# EAGLE schematic 6packRev2A (EAGLE 9.2.0)
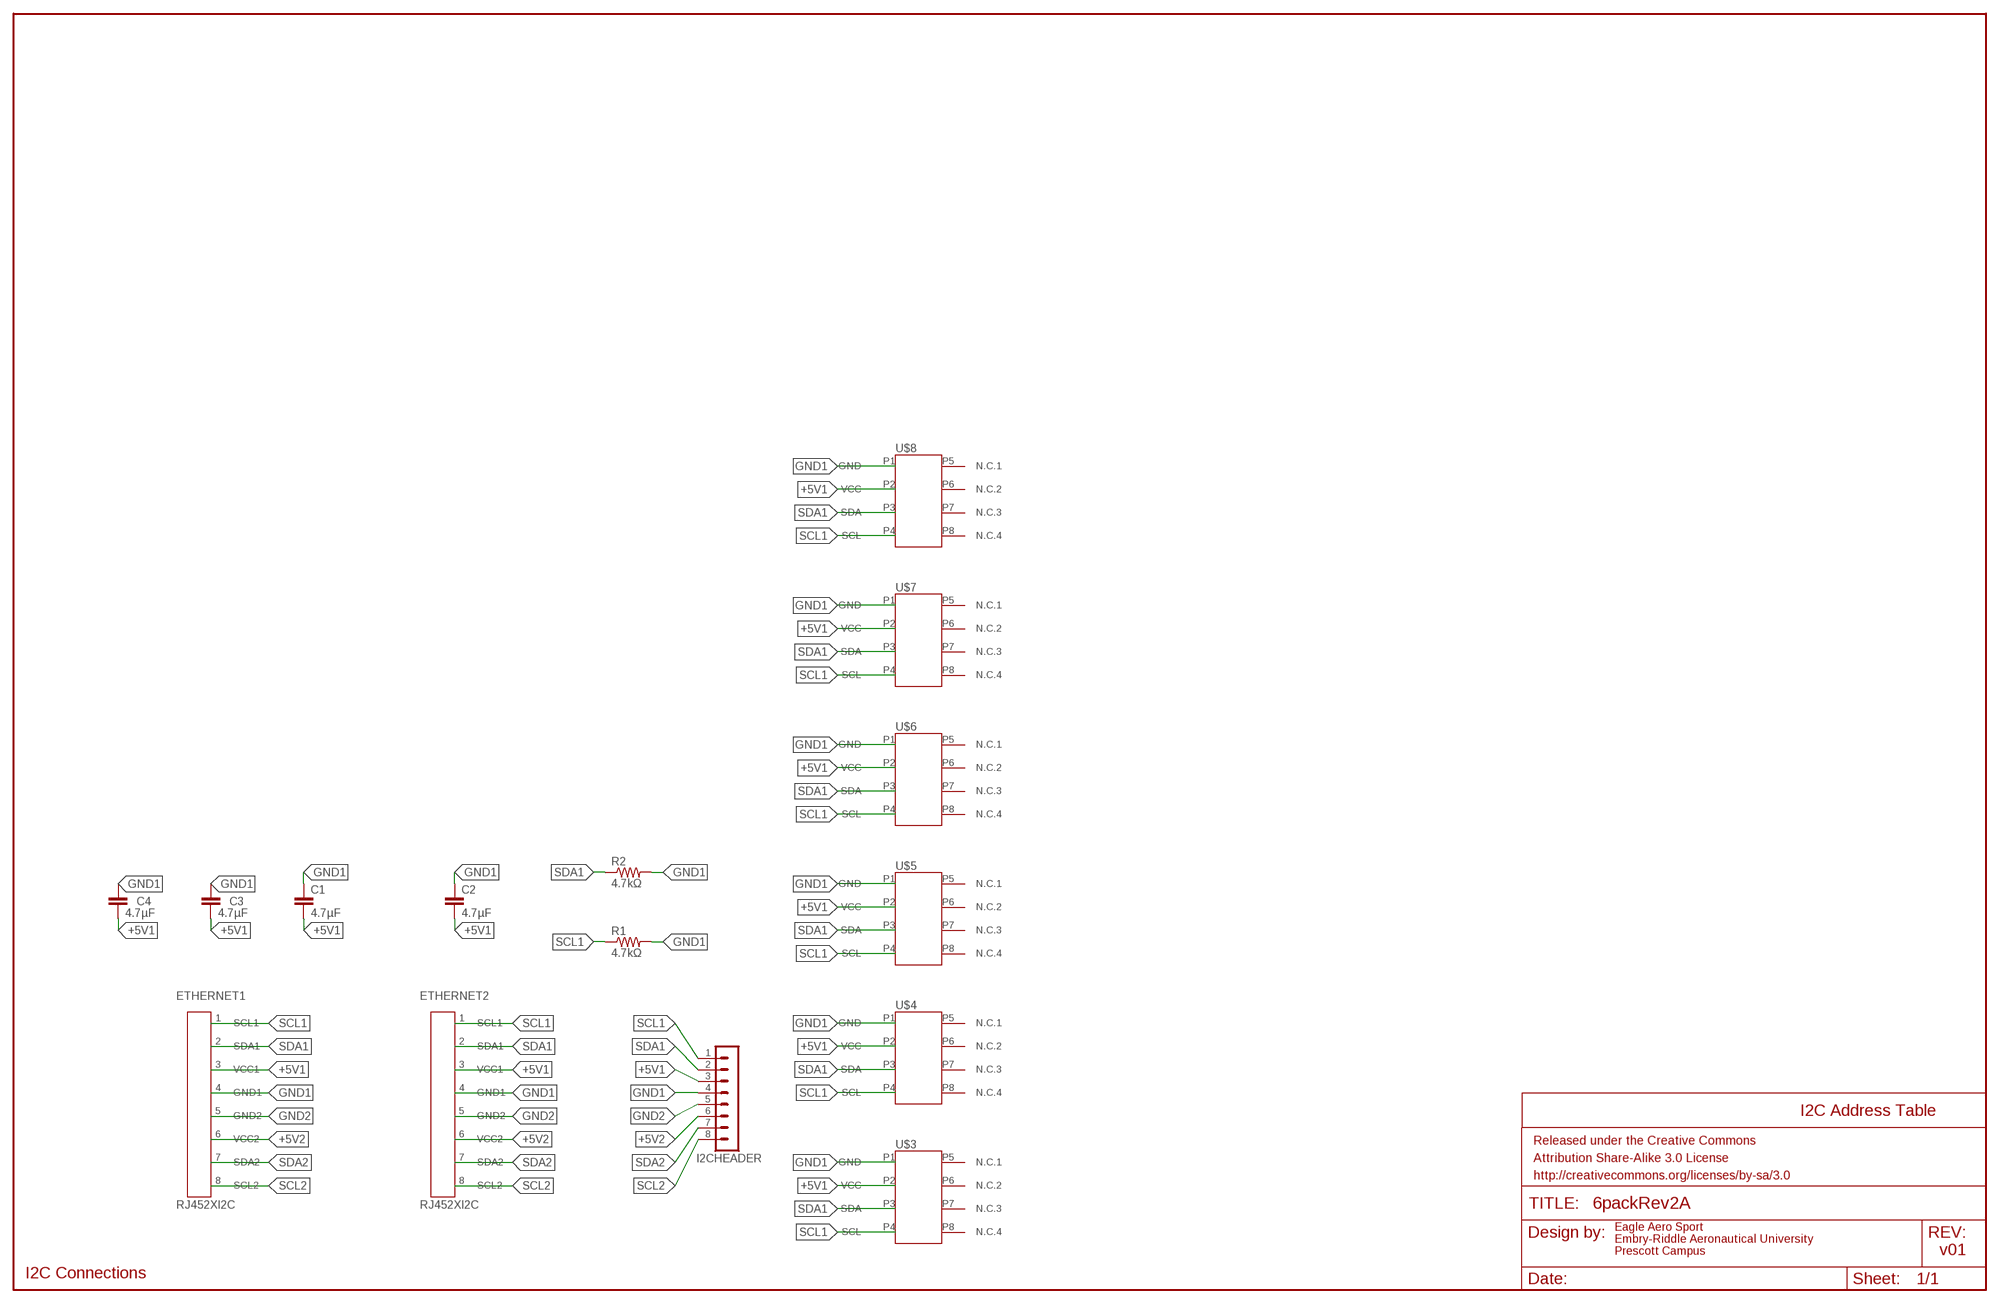
[diagram p0: schematic, sheet 1]

## Parts
C1  4.7µF  0.33UF/330NF-0805-50V-10%  [0805]
C2  4.7µF  0.33UF/330NF-0805-50V-10%  [0805]
C3  4.7µF  10NF-PTH-10MM-10000V-1-%  [CAP-PTH-10MM]
C4  4.7µF  10NF-PTH-10MM-10000V-1-%  [CAP-PTH-10MM]
ETHERNET1  RJ452XI2C  [RJ45-8]
ETHERNET2  RJ452XI2C  [RJ45-8]
FRAME1  FRAME-LEDGER  [CREATIVE_COMMONS]
I2CHEADER  MA08-1  [MA08-1]
R1  4.7kΩ  R-US_0207/10  [0207/10]
R2  4.7kΩ  R-US_0207/10  [0207/10]
U$3  AMS5915  [DIP8W]
U$4  AMS5915  [DIP8W]
U$5  AMS5915  [DIP8W]
U$6  AMS5915  [DIP8W]
U$7  AMS5915  [DIP8W]
U$8  AMS5915  [DIP8W]

## Nets
+5V1: C1.2 C2.2 C3.2 C4.2 ETHERNET1.3(VCC1) ETHERNET2.3(VCC1) I2CHEADER.3 U$3.P2(VCC) U$4.P2(VCC) U$5.P2(VCC) U$6.P2(VCC) U$7.P2(VCC) U$8.P2(VCC)
+5V2: ETHERNET1.6(VCC2) ETHERNET2.6(VCC2) I2CHEADER.6
GND1: C1.1 C2.1 C3.1 C4.1 ETHERNET1.4(GND1) ETHERNET2.4(GND1) I2CHEADER.4 R1.2 R2.2 U$3.P1(GND) U$4.P1(GND) U$5.P1(GND) U$6.P1(GND) U$7.P1(GND) U$8.P1(GND)
GND2: ETHERNET1.5(GND2) ETHERNET2.5(GND2) I2CHEADER.5
SCL1: ETHERNET1.1(SCL1) ETHERNET2.1(SCL1) I2CHEADER.1 R1.1 U$3.P4(SCL) U$4.P4(SCL) U$5.P4(SCL) U$6.P4(SCL) U$7.P4(SCL) U$8.P4(SCL)
SCL2: ETHERNET1.8(SCL2) ETHERNET2.8(SCL2) I2CHEADER.8
SDA1: ETHERNET1.2(SDA1) ETHERNET2.2(SDA1) I2CHEADER.2 R2.1 U$3.P3(SDA) U$4.P3(SDA) U$5.P3(SDA) U$6.P3(SDA) U$7.P3(SDA) U$8.P3(SDA)
SDA2: ETHERNET1.7(SDA2) ETHERNET2.7(SDA2) I2CHEADER.7
Unconnected: U$3.P5(N.C.1) U$3.P6(N.C.2) U$3.P7(N.C.3) U$3.P8(N.C.4) U$4.P5(N.C.1) U$4.P6(N.C.2) U$4.P7(N.C.3) U$4.P8(N.C.4) U$5.P5(N.C.1) U$5.P6(N.C.2) U$5.P7(N.C.3) U$5.P8(N.C.4) U$6.P5(N.C.1) U$6.P6(N.C.2) U$6.P7(N.C.3) U$6.P8(N.C.4) U$7.P5(N.C.1) U$7.P6(N.C.2) U$7.P7(N.C.3) U$7.P8(N.C.4) U$8.P5(N.C.1) U$8.P6(N.C.2) U$8.P7(N.C.3) U$8.P8(N.C.4)

## Notes on the sheet
- I2C Address Table
- Eagle Aero Sport
  Embry-Riddle Aeronautical University
  Prescott Campus
- v01
- I2C Connections

## Library data of the parts
C1 C2 = SparkFun-Capacitors:0.33UF/330NF: 0.33µF/330nF ceramic capacitors A capacitor is a passive two-terminal electrical component used to store electrical energy temporarily in an electric field.; PROD_ID: CAP-08469; VALUE: 0.33µF
C3 C4 = SparkFun-Capacitors:10NF: 0.01uF/10nF/10,000pF ceramic capacitors A capacitor is a passive two-terminal electrical component used to store electrical energy temporarily in an electric field. CAP-09321; PROD_ID: CAP-09321; VALUE: 10nF
ETHERNET1 ETHERNET2 = untitled:RJ452XI2C
FRAME1 = SparkFun-Aesthetics:FRAME-LEDGER: Schematic Frame Standard 11x14 US Ledger frame
I2CHEADER = con-lstb:MA08-1: PIN HEADER; OC_FARNELL: unknown; OC_NEWARK: unknown
R1 R2 = resistor:R-US_: RESISTOR, American symbol
U$3-U$8 = untitled:AMS5915

## Net classes
0 default: width 0.762 mm, clearance 0.762 mm